# Altium project diff_demo.PrjPcb
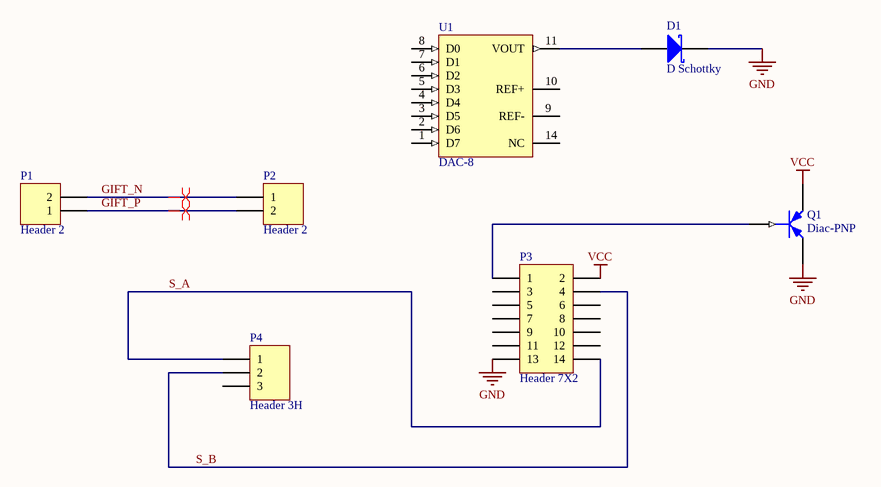
[diagram p0: diff_demo.SchDoc]
1 sheet, 7 parts. Net scope: global (net labels, ports and power ports of the same name join across sheets).
Board file: diff_demo.PcbDoc

## Sheet diff_demo.SchDoc
size D

### Parts
D1  D Schottky  [SMB]
P1  Header 2  [HDR1X2]
P2  Header 2  [HDR1X2]
P3  Header 7X2  [HDR2X7]
P4  Header 3H  [HDR1X3H]
Q1  Diac-PNP  [SOT89L]
U1  DAC-8  [SOT402-1_L]

### Nets
GND: D1.2(K) P3.13 Q1.3(C) U1.12(GND)
VCC: P3.2 Q1.2(E) U1.13(VCC)
GIFT_N: P1.2 P2.1
GIFT_P: P1.1 P2.2
S_A: P3.14 P4.1
S_B: P3.4 P4.2
NetD1_1: D1.1(A) U1.11(VOUT)
NetP3_1: P3.1 Q1.1(B)

Not connected (* = marked no-connect by the designer): P3 3 5 6 7 8 9 10 11 12; P4 3; U1 1(D7) 2(D6) 3(D5) 4(D4) 5(D3) 6(D2) 7(D1) 8(D0) 9(REF-) 10(REF+) 14(NC)

### Layout directives
differential pair: GIFT_N, GIFT_P

### Library data of the parts
D1 = D Schottky: Schottky Diode; Published: 8-Jun-2000; LatestRevisionDate: 17-Jul-2002; LatestRevisionNote: Re-released for DXP Platform.; PackageReference: SMB; Publisher: Altium Limited; PackageDescription: DO-214-AA/SMB; 2 C-Bend Leads; Body 5.3 x 3.6 mm, inc. leads (LxW); Code_JEDEC: DO-214-AA
P1 P2 = Header 2: Header, 2-Pin; LatestRevisionDate: 17-Jul-2002; LatestRevisionNote: Re-released for DXP Platform.; Publisher: Altium Limited
P3 = Header 7X2: Header, 7-Pin, Dual row; LatestRevisionDate: 17-Jul-2002; LatestRevisionNote: Re-released for DXP Platform.; Publisher: Altium Limited
P4 = Header 3H: Header, 3-Pin, Right Angle; LatestRevisionDate: 17-Jul-2002; LatestRevisionNote: Re-released for DXP Platform.; Publisher: Altium Limited
Q1 = Diac-PNP: DIAC; Published: 24-Mar-1999; LatestRevisionDate: 29-May-2009; LatestRevisionNote: IPC-7351 Footprint Added.; PackageVersion: Jul-2004; PackageReference: SOT89; Publisher: Altium Limited; PackageDescription: 3-Pin SOT-89 Package 1.5 mm Pitch, 4.1 mm Lead Span; Code_JEDEC: TO-243-AA
U1 = DAC-8: Generic 8-Bit D/A Converter; Published: 8-Jun-2000; LatestRevisionDate: 29-May-2009; LatestRevisionNote: IPC-7351 Footprint Added.; PackageVersion: Mar-2002; PackageReference: SOT402-1; Publisher: Altium Limited; PackageDescription: 14-Pin Thin Small Outline Package 0.65 mm Pitch; Code_JEDEC: MO-153